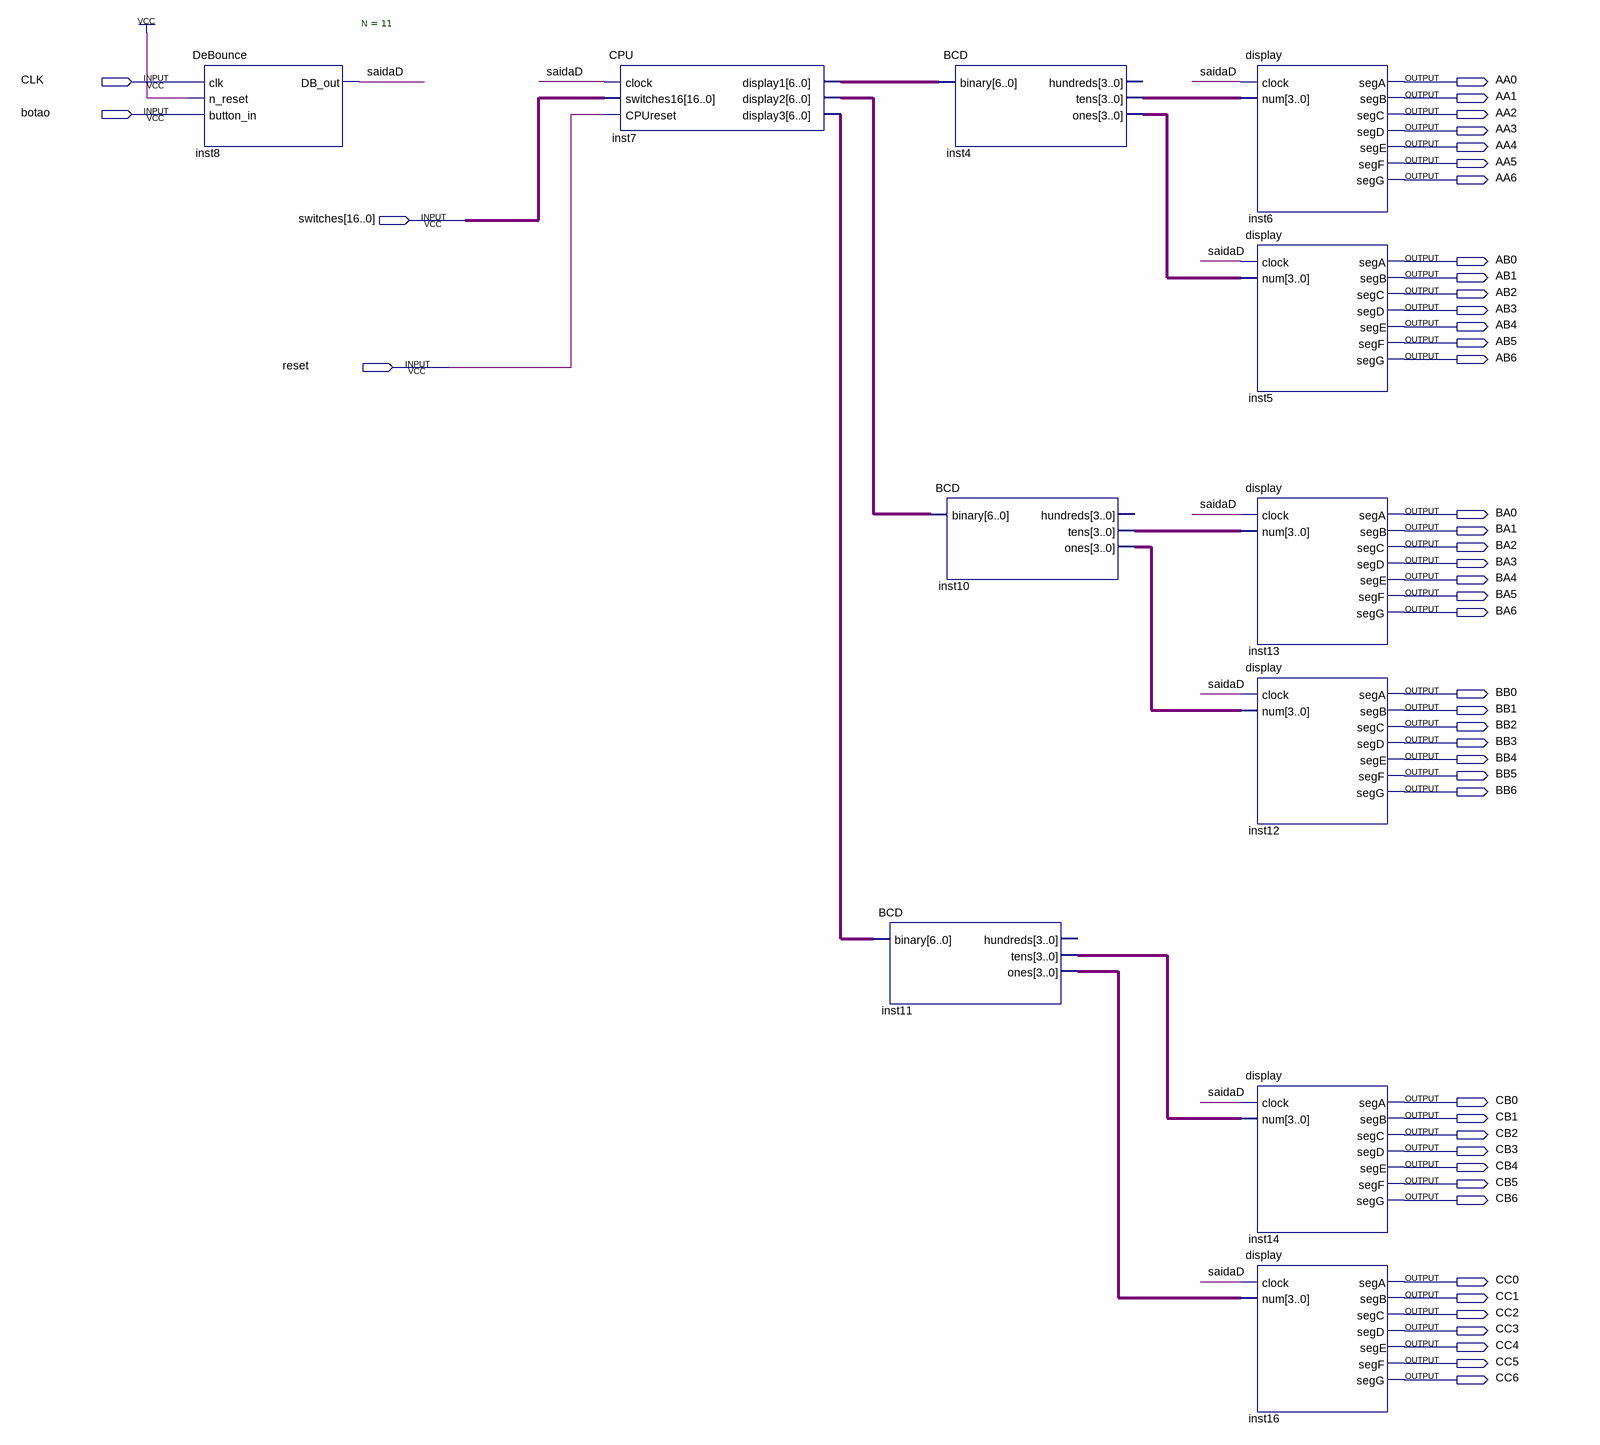
[diagram p0: schematic sheet]
// Quartus schematic Testef2.bdf as structural Verilog: 11 symbols, 46 pins
module Testef2 (
  input  CLK,
  input  botao,
  input  [16:0] switches,
  input  reset,
  output AA0,
  output AA1,
  output AA2,
  output AA3,
  output AA4,
  output AA5,
  output AA6,
  output AB0,
  output AB1,
  output AB2,
  output AB3,
  output AB4,
  output AB5,
  output AB6,
  output BA0,
  output BA1,
  output BA2,
  output BA3,
  output BA4,
  output BA5,
  output BA6,
  output BB0,
  output BB1,
  output BB2,
  output BB3,
  output BB4,
  output BB5,
  output BB6,
  output CB0,
  output CB1,
  output CB2,
  output CB3,
  output CB4,
  output CB5,
  output CB6,
  output CC0,
  output CC1,
  output CC2,
  output CC3,
  output CC4,
  output CC5,
  output CC6
);

  wire saidaD;
  wire [3:0] inst4_ones, inst4_tens, inst10_ones, inst10_tens, inst11_ones, inst11_tens;
  wire [6:0] inst7_display1, inst7_display2, inst7_display3;

  DeBounce #(.N(11)) inst8 (.clk(CLK), .n_reset(1'b1), .button_in(botao), .DB_out(saidaD));
  CPU inst7 (
    .clock(saidaD), .switches16(switches), .CPUreset(reset), .display1(inst7_display1),
    .display2(inst7_display2), .display3(inst7_display3));
  BCD inst11 (.binary(inst7_display3), .tens(inst11_tens), .ones(inst11_ones));  // open: hundreds
  BCD inst4 (.binary(inst7_display1), .tens(inst4_tens), .ones(inst4_ones));  // open: hundreds
  BCD inst10 (.binary(inst7_display2), .tens(inst10_tens), .ones(inst10_ones));  // open: hundreds
  display inst6 (
    .clock(saidaD), .num(inst4_tens), .segA(AA0), .segB(AA1), .segC(AA2), .segD(AA3), .segE(AA4), .segF(AA5),
    .segG(AA6));
  display inst5 (
    .clock(saidaD), .num(inst4_ones), .segA(AB0), .segB(AB1), .segC(AB2), .segD(AB3), .segE(AB4), .segF(AB5),
    .segG(AB6));
  display inst13 (
    .clock(saidaD), .num(inst10_tens), .segA(BA0), .segB(BA1), .segC(BA2), .segD(BA3), .segE(BA4),
    .segF(BA5), .segG(BA6));
  display inst12 (
    .clock(saidaD), .num(inst10_ones), .segA(BB0), .segB(BB1), .segC(BB2), .segD(BB3), .segE(BB4),
    .segF(BB5), .segG(BB6));
  display inst14 (
    .clock(saidaD), .num(inst11_tens), .segA(CB0), .segB(CB1), .segC(CB2), .segD(CB3), .segE(CB4),
    .segF(CB5), .segG(CB6));
  display inst16 (
    .clock(saidaD), .num(inst11_ones), .segA(CC0), .segB(CC1), .segC(CC2), .segD(CC3), .segE(CC4),
    .segF(CC5), .segG(CC6));
endmodule
